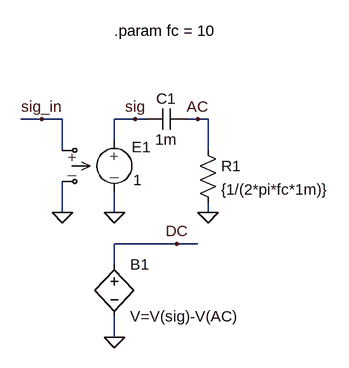
[diagram p0: schematic mixed2ac_dc_small.asc]
mixed2ac_dc_small.asc, the LTspice schematic file:
Version 4
SHEET 1 880 680
WIRE -128 -176 -160 -176
WIRE -96 -176 -128 -176
WIRE 16 -176 -16 -176
WIRE 32 -176 16 -176
WIRE 112 -176 96 -176
WIRE 128 -176 112 -176
WIRE -16 -144 -16 -176
WIRE -96 -128 -96 -176
WIRE 128 -128 128 -176
WIRE -96 -32 -96 -80
WIRE -16 -32 -16 -64
WIRE 128 -32 128 -48
WIRE 80 16 -16 16
WIRE 112 16 80 16
WIRE -16 48 -16 16
WIRE -16 160 -16 128
FLAG -96 -32 0
FLAG -16 -32 0
FLAG 128 -32 0
FLAG -128 -176 sig_in
FLAG 112 -176 AC
FLAG -16 160 0
FLAG 80 16 DC
FLAG 16 -176 sig
SYMBOL crtl-V-V -16 -160 R0
SYMATTR InstName E1
SYMATTR Value 1
SYMBOL res 112 -144 R0
SYMATTR InstName R1
SYMATTR Value {1/(2*pi*fc*1m)}
SYMBOL cap 32 -160 R270
WINDOW 0 32 32 VTop 2
WINDOW 3 0 32 VBottom 2
SYMATTR InstName C1
SYMATTR Value 1m
SYMBOL bv -16 32 R0
SYMATTR InstName B1
SYMATTR Value V=V(sig)-V(AC)
TEXT -16 -312 Left 2 !.param fc = 10

The netlist it stands for:
* mixed2ac_dc_small.asc
E1 sig 0 sig_in 0 1
R1 AC 0 {1/(2*pi*fc*1m)}
C1 sig AC 1m
B1 DC 0 V=V(sig)-V(AC)
.param fc = 10
.backanno
.end